# Altium schematic sheet SwipingCard.SchDoc
size B
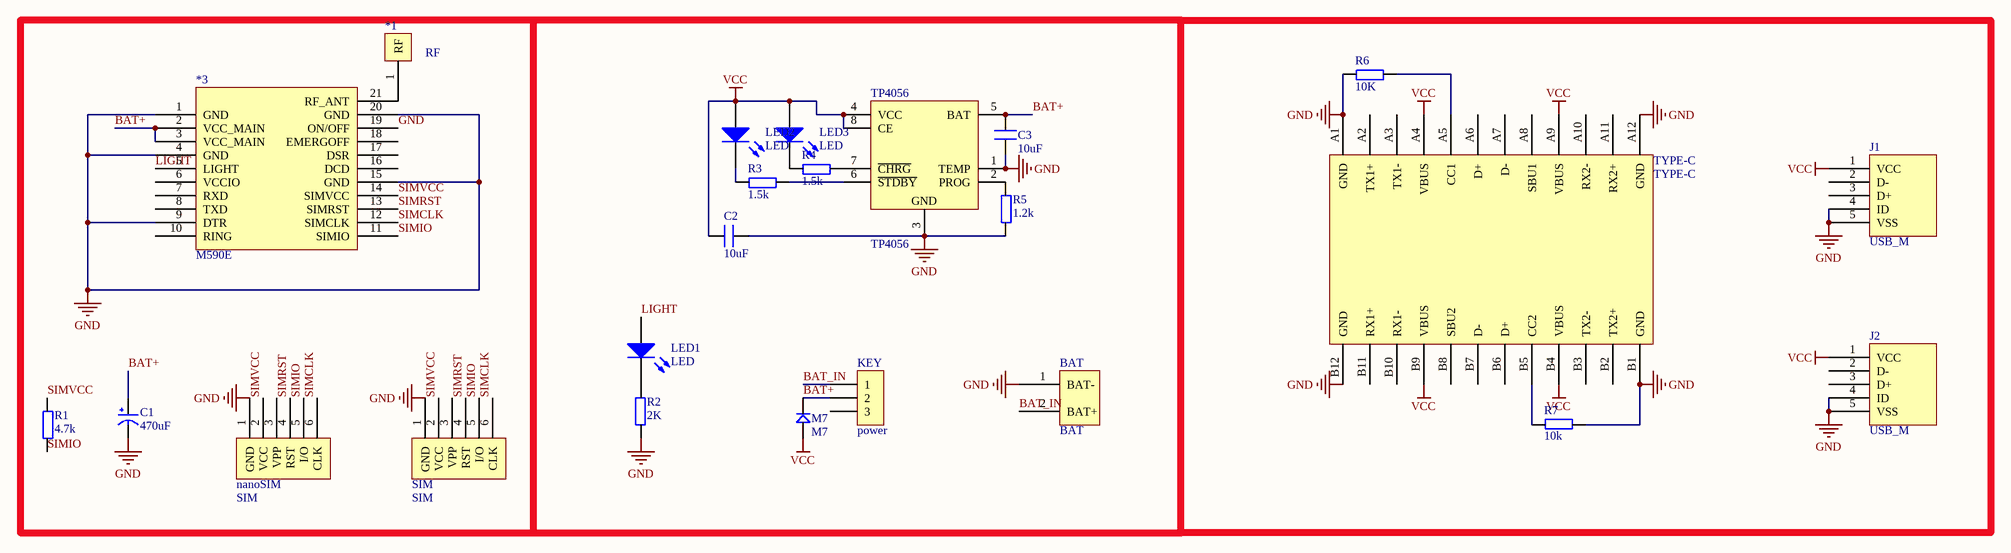
[diagram p0: SwipingCard.SchDoc]

## Parts
*1  RF  [harder1x1]
*3  M590E  [M590E]
BAT  BAT  [HEADER1*2]
C1  470uF  [1206]
C2  10uF  [0603]
C3  10uF  [0603]
J1  USB_M  [USB_MICRO]
J2  USB_M  [micro]
KEY  power  [HARDER1*3]
LED1  LED  [0603]
LED2  LED  [0603]
LED3  LED  [0603]
M7  M7  [DIODE_SOP]
nanoSIM  SIM  [nanoSIM]
R1  4.7k  [0603]
R2  2K  [0603]
R3  1.5k  [0603]
R4  1.5k  [0603]
R5  1.2k  [0603]
R6  10K  [0603]
R7  10k  [0603]
SIM  SIM  [microSIM]
TP4056  TP4056  [TP4056]
TYPE-C  TYPE-C  [TYPE-C]

## Nets
GND: *3.1(GND) *3.4(GND) *3.9(DTR) *3.15(GND) *3.19(ON/OFF) *3.20(GND) BAT.1(BAT-) C1.2(GND) C2.2 C3.1 J1.4(ID) J1.5(VSS) J2.4(ID) J2.5(VSS) nanoSIM.1(GND) R2.2 R5.1 R6.1 R7.1 SIM.1(GND) TP4056.1(TEMP) TP4056.3(GND) TYPE-C.A1(GND) TYPE-C.A12(GND) TYPE-C.B1(GND) TYPE-C.B12(GND)
VCC: C2.1 J1.1(VCC) J2.1(VCC) LED2.1(A) LED3.1(A) M7.1 TP4056.4(VCC) TP4056.8(CE) TYPE-C.A4(VBUS) TYPE-C.A9(VBUS) TYPE-C.B4(VBUS) TYPE-C.B9(VBUS)
BAT+: *3.2(VCC_MAIN) *3.3(VCC_MAIN) C1.1(VCC) C3.2 KEY.2 M7.2 TP4056.5(BAT)
BAT_IN: BAT.2(BAT+) KEY.1
LIGHT: *3.5(LIGHT) LED1.1(A)
SIMCLK: *3.12(SIMCLK) nanoSIM.6(CLK) SIM.6(CLK)
SIMIO: *3.11(SIMIO) nanoSIM.5(I/O) R1.1 SIM.5(I/O)
SIMRST: *3.13(SIMRST) nanoSIM.4(RST) SIM.4(RST)
SIMVCC: *3.14(SIMVCC) nanoSIM.2(VCC) R1.2 SIM.2(VCC)
Net*1_1: *1.1(RF) *3.21(RF_ANT)
NetLED1_2: LED1.2(K) R2.1
NetLED2_2: LED2.2(K) R3.1
NetLED3_2: LED3.2(K) R4.1
NetR3_2: R3.2 TP4056.6(~{STDBY})
NetR4_2: R4.2 TP4056.7(~{CHRG})
NetR5_2: R5.2 TP4056.2(PROG)
NetR6_2: R6.2 TYPE-C.A5(CC1)
NetR7_2: R7.2 TYPE-C.B5(CC2)

Not connected (* = marked no-connect by the designer): *3 6(VCCIO) 7(RXD) 8(TXD) 10(RING) 16(DCD) 17(DSR) 18(EMERGOFF); J1 2(D-) 3(D+); J2 2(D-) 3(D+); KEY 3; nanoSIM 3(VPP); SIM 3(VPP); TYPE-C A2(TX1+) A3(TX1-) A6(D+) A7(D-) A8(SBU1) A10(RX2-) A11(RX2+) B2(TX2+) B3(TX2-) B6(D+) B7(D-) B8(SBU2) B10(RX1-) B11(RX1+)

## Library data of the parts
*1 = harder1x1
C1 = C
C2 C3 = cap
J1 J2 = USB_M: MicroUSB接口
R1-R7 = R